# Altium schematic sheet float.SchDoc
size A
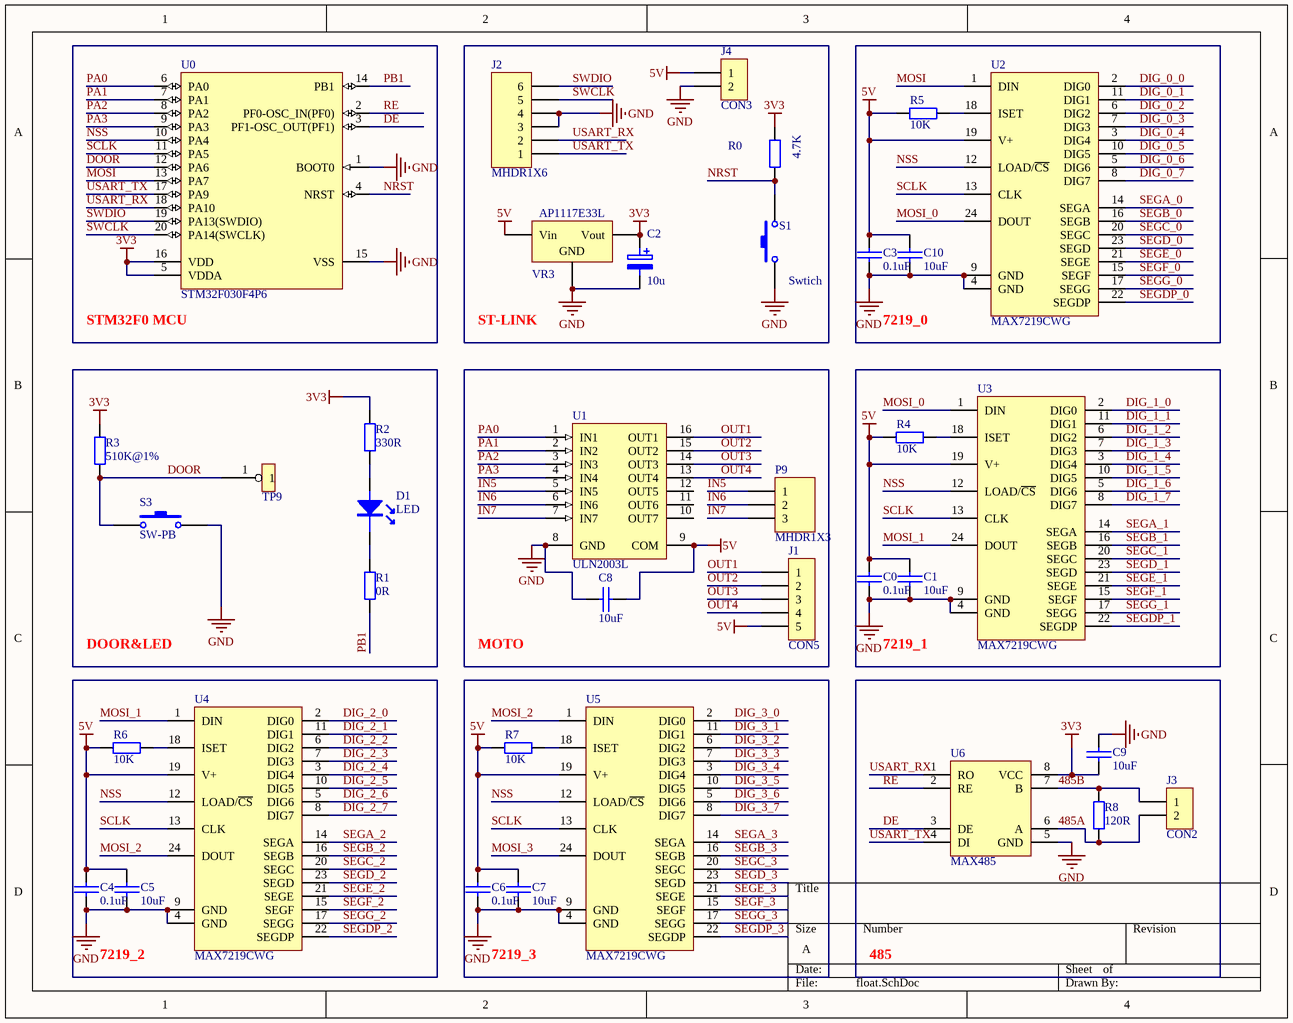
[diagram p0: float.SchDoc]

## Parts
C0  0.1uF  [0603C]
C1  10uF  [0603C]
C2  10u  [LC-CASE-B_3528]
C3  0.1uF  [0603C]
C4  0.1uF  [0603C]
C5  10uF  [0603C]
C6  0.1uF  [0603C]
C7  10uF  [0603C]
C8  10uF  [0603C]
C9  10uF  [0603C]
C10  10uF  [0603C]
D1  LED  [LC-0603_LED_S1]
J1  CON5  [HDR1X5]
J2  MHDR1X6  [HDR1X6]
J3  CON2  [HDR1X2]
J4  CON3  [HDR1X2]
P9  MHDR1X3  [HDR1X3]
R0  value 4.7K  [0603R]  (hidden comment: RES)
R1  value 0R  [0603R]  (hidden comment: Res1)
R2  value 330R  [0603R]  (hidden comment: Res1)
R3  value 510K@1%  [0603R]  (hidden comment: Res)
R4  value 10K  [0603R]  (hidden comment: RES)
R5  value 10K  [0603R]  (hidden comment: RES)
R6  value 10K  [0603R]  (hidden comment: RES)
R7  value 10K  [0603R]  (hidden comment: RES)
R8  value 120R  [0603R]  (hidden comment: RES)
S1  value Swtich  [KEY_M]  (hidden comment: Switch)
S3  SW-PB  [reed_switch]
TP9  TP  [TP1]  (value not drawn)
U0  STM32F030F4P6  [STM-TSSOP20_L]
U1  ULN2003L  [NSO16_M]
U2  MAX7219CWG  [SO-24W]
U3  MAX7219CWG  [SO-24W]
U4  MAX7219CWG  [SO-24W]
U5  MAX7219CWG  [SO-24W]
U6  MAX485  [NSO8_N]
VR3  AP1117E33L  [LC-SOT-223]

## Nets
3V3: C2.1 C9.1 R0.1 R2.1 R3.1 U0.5(VDDA) U0.16(VDD) U6.8(VCC) VR3.2(Vout)
5V: C0.2 C1.2 C3.2 C4.2 C5.2 C6.2 C7.2 C8.2 C10.2 J1.5 J4.1 R4.1 R5.1 R6.1 R7.1 U1.9(COM) U2.19(V+) U3.19(V+) U4.19(V+) U5.19(V+) VR3.3(Vin)
GND: C0.1 C1.1 C2.2 C3.1 C4.1 C5.1 C6.1 C7.1 C8.1 C9.2 C10.1 J2.3 J2.4 J4.2 S1.1 S3.2 U0.1(BOOT0) U0.15(VSS) U1.8(GND) U2.4(GND) U2.9(GND) U3.4(GND) U3.9(GND) U4.4(GND) U4.9(GND) U5.4(GND) U5.9(GND) U6.5(GND) VR3.1(GND)
485A: J3.2 R8.1 U6.6(A)
485B: J3.1 R8.2 U6.7(B)
DE: U0.3(PF1-OSC_OUT(PF1)) U6.3(DE)
DIG_0_0: U2.2(DIG0)
DIG_0_1: U2.11(DIG1)
DIG_0_2: U2.6(DIG2)
DIG_0_3: U2.7(DIG3)
DIG_0_4: U2.3(DIG4)
DIG_0_5: U2.10(DIG5)
DIG_0_6: U2.5(DIG6)
DIG_0_7: U2.8(DIG7)
DIG_1_0: U3.2(DIG0)
DIG_1_1: U3.11(DIG1)
DIG_1_2: U3.6(DIG2)
DIG_1_3: U3.7(DIG3)
DIG_1_4: U3.3(DIG4)
DIG_1_5: U3.10(DIG5)
DIG_1_6: U3.5(DIG6)
DIG_1_7: U3.8(DIG7)
DIG_2_0: U4.2(DIG0)
DIG_2_1: U4.11(DIG1)
DIG_2_2: U4.6(DIG2)
DIG_2_3: U4.7(DIG3)
DIG_2_4: U4.3(DIG4)
DIG_2_5: U4.10(DIG5)
DIG_2_6: U4.5(DIG6)
DIG_2_7: U4.8(DIG7)
DIG_3_0: U5.2(DIG0)
DIG_3_1: U5.11(DIG1)
DIG_3_2: U5.6(DIG2)
DIG_3_3: U5.7(DIG3)
DIG_3_4: U5.3(DIG4)
DIG_3_5: U5.10(DIG5)
DIG_3_6: U5.5(DIG6)
DIG_3_7: U5.8(DIG7)
DOOR: R3.2 S3.1 TP9.1 U0.12(PA6)
IN5: P9.1 U1.5(IN5)
IN6: P9.2 U1.6(IN6)
IN7: P9.3 U1.7(IN7)
MOSI: U0.13(PA7) U2.1(DIN)
MOSI_0: U2.24(DOUT) U3.1(DIN)
MOSI_1: U3.24(DOUT) U4.1(DIN)
MOSI_2: U4.24(DOUT) U5.1(DIN)
MOSI_3: U5.24(DOUT)
NRST: R0.2 S1.2 U0.4(NRST)
NSS: U0.10(PA4) U2.12(LOAD/~{CS}) U3.12(LOAD/~{CS}) U4.12(LOAD/~{CS}) U5.12(LOAD/~{CS})
OUT1: J1.1 U1.16(OUT1)
OUT2: J1.2 U1.15(OUT2)
OUT3: J1.3 U1.14(OUT3)
OUT4: J1.4 U1.13(OUT4)
PA0: U0.6(PA0) U1.1(IN1)
PA1: U0.7(PA1) U1.2(IN2)
PA2: U0.8(PA2) U1.3(IN3)
PA3: U0.9(PA3) U1.4(IN4)
PB1: R1.2 U0.14(PB1)
RE: U0.2(PF0-OSC_IN(PF0)) U6.2(RE)
SCLK: U0.11(PA5) U2.13(CLK) U3.13(CLK) U4.13(CLK) U5.13(CLK)
SEGA_0: U2.14(SEGA)
SEGA_1: U3.14(SEGA)
SEGA_2: U4.14(SEGA)
SEGA_3: U5.14(SEGA)
SEGB_0: U2.16(SEGB)
SEGB_1: U3.16(SEGB)
SEGB_2: U4.16(SEGB)
SEGB_3: U5.16(SEGB)
SEGC_0: U2.20(SEGC)
SEGC_1: U3.20(SEGC)
SEGC_2: U4.20(SEGC)
SEGC_3: U5.20(SEGC)
SEGD_0: U2.23(SEGD)
SEGD_1: U3.23(SEGD)
SEGD_2: U4.23(SEGD)
SEGD_3: U5.23(SEGD)
SEGDP_0: U2.22(SEGDP)
SEGDP_1: U3.22(SEGDP)
SEGDP_2: U4.22(SEGDP)
SEGDP_3: U5.22(SEGDP)
SEGE_0: U2.21(SEGE)
SEGE_1: U3.21(SEGE)
SEGE_2: U4.21(SEGE)
SEGE_3: U5.21(SEGE)
SEGF_0: U2.15(SEGF)
SEGF_1: U3.15(SEGF)
SEGF_2: U4.15(SEGF)
SEGF_3: U5.15(SEGF)
SEGG_0: U2.17(SEGG)
SEGG_1: U3.17(SEGG)
SEGG_2: U4.17(SEGG)
SEGG_3: U5.17(SEGG)
SWCLK: J2.5 U0.20(PA14(SWCLK))
SWDIO: J2.6 U0.19(PA13(SWDIO))
USART_RX: J2.2 U0.18(PA10) U6.1(RO)
USART_TX: J2.1 U0.17(PA9) U6.4(DI)
NetD1_A: D1.A R2.2
NetD1_K: D1.K R1.1
NetR4_2: R4.2 U3.18(ISET)
NetR5_2: R5.2 U2.18(ISET)
NetR6_2: R6.2 U4.18(ISET)
NetR7_2: R7.2 U5.18(ISET)

Not connected (* = marked no-connect by the designer): U1 10(OUT7) 11(OUT6) 12(OUT5)

## Notes on the sheet
- (near U0) STM32F0 MCU
- (near VR3) ST-LINK
- 7219_0
- DOOR&LED
- MOTO
- 7219_1
- 7219_2
- 7219_3
- 485

## Library data of the parts
C0 C1 C3-C10 = CAP: Capacitor
C2 = ELECTRO2
J1 = CON5: Connector
J2 = MHDR1X6: Header, 6-Pin; LatestRevisionDate: 17-Jul-2002; LatestRevisionNote: Re-released for DXP Platform.; Publisher: Altium Limited
J3 J4 = CON2: Connector
P9 = MHDR1X3: Header, 3-Pin; LatestRevisionDate: 17-Jul-2002; LatestRevisionNote: Re-released for DXP Platform.; Publisher: Altium Limited
R0 R3-R8 = Res2: Resistor; Published: 8-Jun-2000; LatestRevisionDate: 17-Jul-2002; LatestRevisionNote: Re-released for DXP Platform.; PackageReference: AXIAL-0.4; Publisher: Altium Limited
  R3: PackageDescription: Axial Device, Thru-Hole; 2 Leads; 0.4 in Pin Spacing
R1 R2 = Res1: 贴片电阻; Published: 8-Jun-2000; LatestRevisionDate: 17-Jul-2002; LatestRevisionNote: Re-released for DXP Platform.; PackageReference: AXIAL-0.4; Publisher: Altium Limited
S1 = SW-PB: Published: 24-Mar-1999; LatestRevisionDate: 17-Jul-2002; LatestRevisionNote: Re-released for DXP Platform.; PackageReference: SPST-2; Publisher: Altium Limited
S3 = SW-PB: Switch; Published: 24-Mar-1999; LatestRevisionDate: 17-Jul-2002; LatestRevisionNote: Re-released for DXP Platform.; PackageReference: SPST-2; Publisher: Altium Limited
U0 = STM32F030F4P6: ARM Cortex-M0 32-bit MCU, 16 KB Flash, 4 KB Internal RAM, 15 I/Os, 20-pin TSSOP, -40 to 85 degC, Tube; FLASH Size (Prog) (kB): 16; I/Os (High Current): 15; Internal RAM Size (kB): 4; Operating Frequency(F) (Processor speed) (MHz): 48; Supply Voltage(Vcc) min (V): 2.4; DatasheetVersion: Rev. 1; PackageVersion: Rev. 1, 11/2012; PackageReference: TSSOP20; PackageDescription: 20-Pin Thin Shrink Small Outline Package, 6.5 x 4.4 mm Body, 0.65 mm Pitch; Supplier 1: Digi-Key; Supplier Part Number 1: 497-14044-5-ND; Supplier 2: Newark; Supplier Part Number 2: 06X3648; Supplier 3: Mouser; Supplier Part Number 3: 511-STM32F030F4P6; Core: ARM Cortex-M0; Packing: Tube; Mounting Technology: Surface Mount; PartNumber: STM32F030F4P6; ComponentLink1Description: Manufacturer URL; ComponentLink1URL: http://www.st.com/web/en/home.html; ComponentLink2Description: Datasheet; ComponentLink2URL: http://www.st.com/st-web-ui/static/active/en/resource/technical/document/datasheet/DM00088500.pdf; ComponentLink3Description: Package Specification; ComponentLink3URL: http://www.st.com/st-web-ui/static/active/en/resource/technical/document/datasheet/DM00065136.pdf
U1 = ULN2003L: 驱动芯片; Published: 13-Oct-2000; LatestRevisionDate: 13-Apr-2006; LatestRevisionNote: IPC-7351 Footprint Added.; DatasheetVersion: 1998; PackageReference: L16; Publisher: Altium Limited; PackageDescription: 16-Pin Small Outline Integrated Circuit 1.27 mm Pitch; Code_JEDEC: MS-012-AC; Code_IPC: SOIC127P600-16; ComponentLink1Description: Manufacturer Link; ComponentLink1URL: http://www.allegromicro.com/
U2-U5 = MAX7219CWG: CI-MAX7219CWG
U6 = SP3485: 485总线芯片
VR3 = Volt Reg: Voltage Regulator; Published: 24-Mar-1999; LatestRevisionDate: 17-Jul-2002; LatestRevisionNote: Re-released for DXP Platform.; Publisher: Altium Limited; Code_JEDEC: SMD-220